# EAGLE design RN-XV_ZigBeeFootprint (EAGLE 6.6.0)
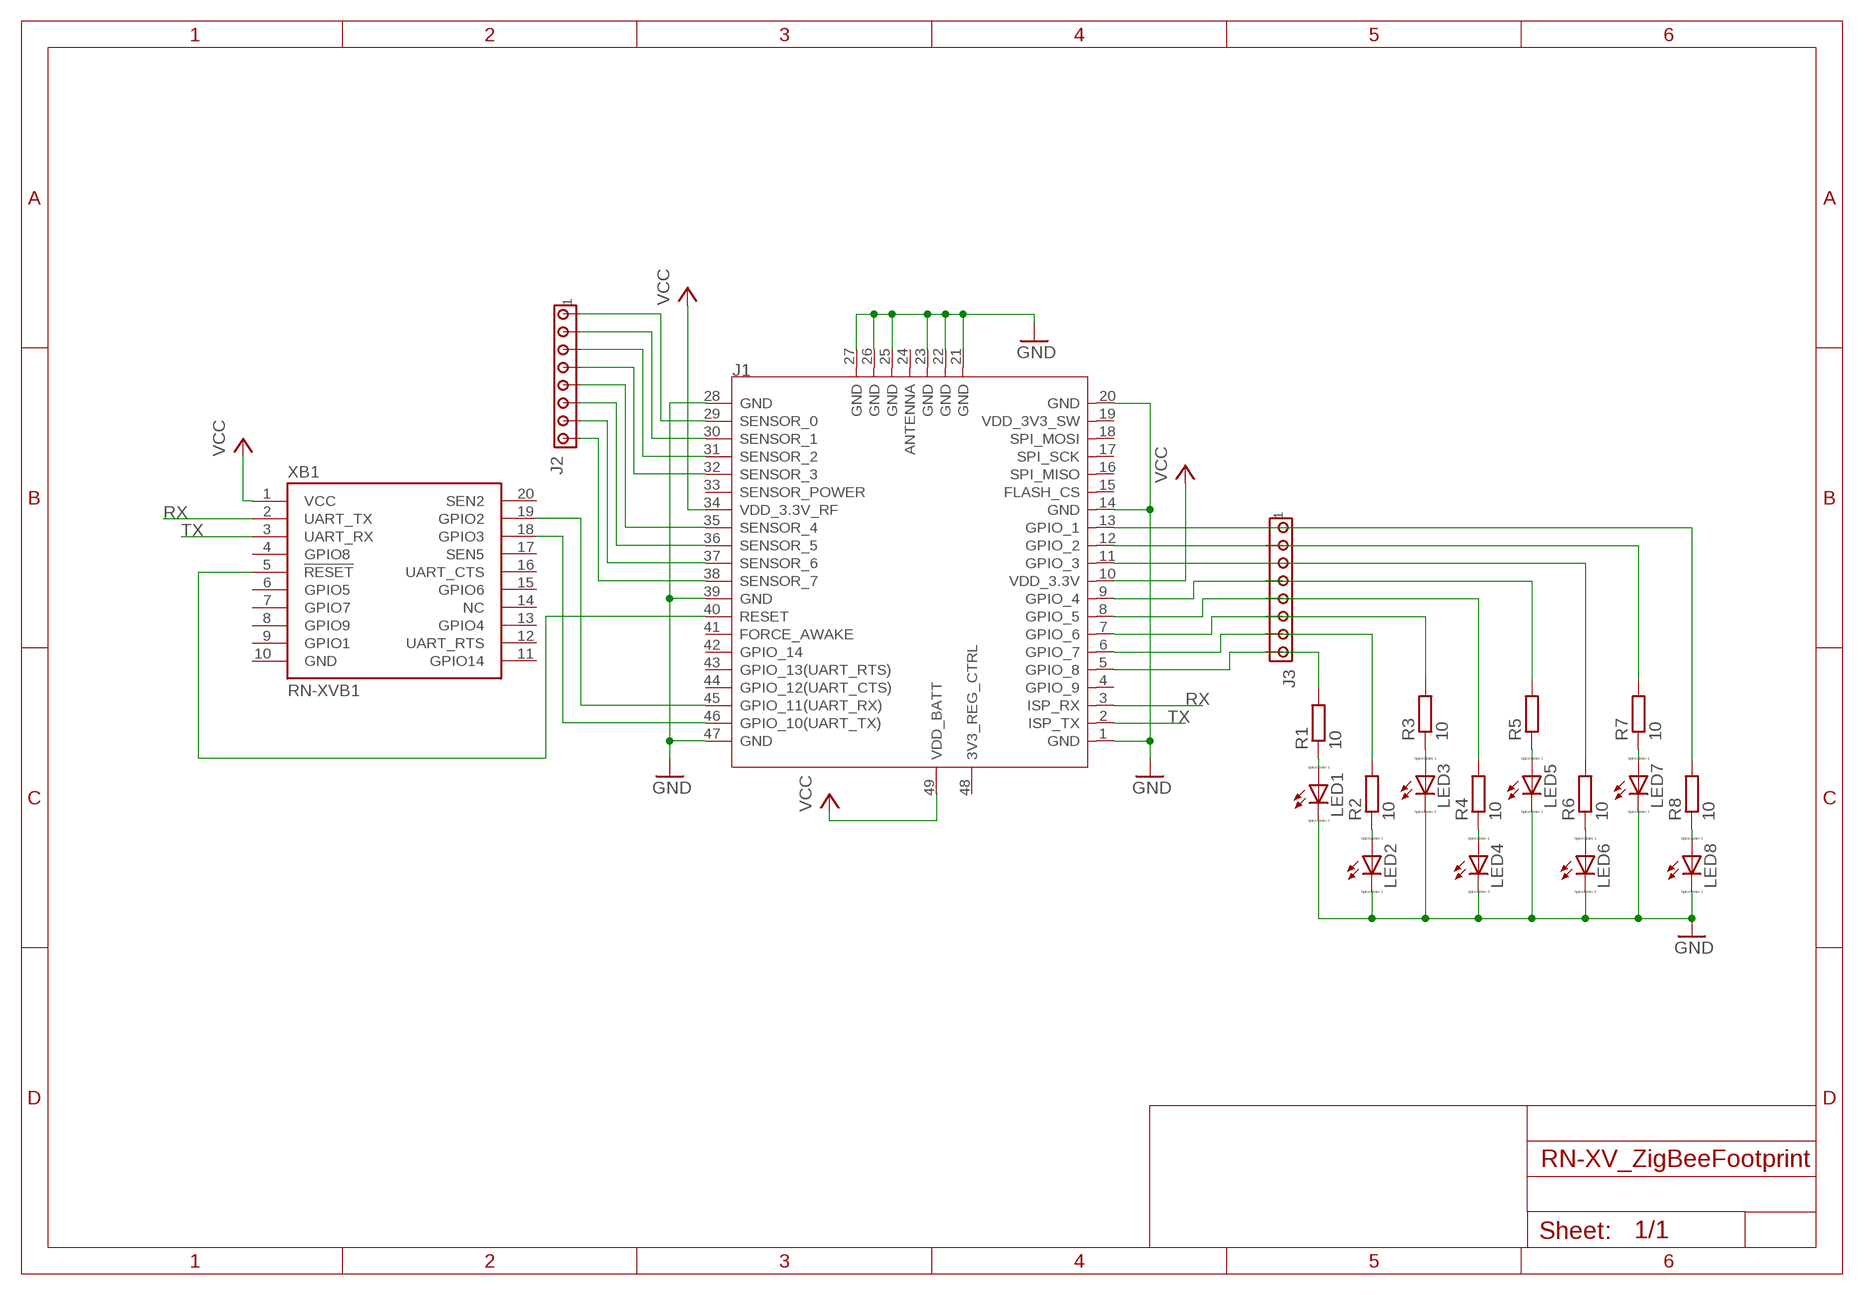
[diagram p0: schematic, sheet 1]

## Parts
J1  MODULE_WIFI-RN-171  [MODULE_49P-1.27-26.67X17.78]
J2  MTA08-100  [10X08MTA]
J3  MTA08-100  [10X08MTA]
LED1  LED_ELD260  [LED_LD260]
LED2  LED_ELD260  [LED_LD260]
LED3  LED_ELD260  [LED_LD260]
LED4  LED_ELD260  [LED_LD260]
LED5  LED_ELD260  [LED_LD260]
LED6  LED_ELD260  [LED_LD260]
LED7  LED_ELD260  [LED_LD260]
LED8  LED_ELD260  [LED_LD260]
R1  10  R-EU_MELF0102W  [MINI_MELF-0102W]
R2  10  R-EU_MELF0102W  [MINI_MELF-0102W]
R3  10  R-EU_MELF0102W  [MINI_MELF-0102W]
R4  10  R-EU_MELF0102W  [MINI_MELF-0102W]
R5  R-EU_MELF0102W  [MINI_MELF-0102W]
R6  10  R-EU_MELF0102W  [MINI_MELF-0102W]
R7  10  R-EU_MELF0102W  [MINI_MELF-0102W]
R8  10  R-EU_MELF0102W  [MINI_MELF-0102W]
XB1  RN-XVB1  [XBEE]

## Nets
GND: J1.1(GND) J1.14(GND) J1.20(GND) J1.21(GND) J1.22(GND) J1.23(GND) J1.25(GND) J1.26(GND) J1.27(GND) J1.28(GND) J1.39(GND) J1.47(GND) LED1.K(C) LED2.K(C) LED3.K(C) LED4.K(C) LED5.K(C) LED6.K(C) LED7.K(C) LED8.K(C)
N$1: J1.38(SENSOR_7) J2.8
N$2: J1.37(SENSOR_6) J2.7
N$3: J1.40(RESET) XB1.5(!RESET)
N$4: J1.46(GPIO_10(UART_TX)) XB1.18(GPIO3)
N$5: J1.45(GPIO_11(UART_RX)) XB1.19(GPIO2)
N$6: J1.36(SENSOR_5) J2.6
N$7: J1.35(SENSOR_4) J2.5
N$8: J1.32(SENSOR_3) J2.4
N$9: J1.30(SENSOR_1) J2.2
N$10: J1.29(SENSOR_0) J2.1
N$11: J1.31(SENSOR_2) J2.3
N$20: LED1.A R1.1
N$23: LED2.A R2.1
N$24: LED3.A R3.1
N$25: LED4.A R4.1
N$26: LED5.A R5.1
N$27: LED6.A R6.1
N$28: LED7.A R7.1
N$29: LED8.A R8.1
N$30: J1.5(GPIO_8) J3.8 R1.2
N$31: J1.6(GPIO_7) J3.7 R2.2
N$32: J1.7(GPIO_6) J3.6 R3.2
N$33: J1.8(GPIO_5) J3.5 R4.2
N$34: J1.9(GPIO_4) J3.4 R5.2
N$35: J1.11(GPIO_3) J3.3 R6.2
N$36: J1.12(GPIO_2) J3.2 R7.2
N$37: J1.13(GPIO_1) J3.1 R8.2
RX: J1.3(ISP_RX) XB1.2(UART_TX)
TX: J1.2(ISP_TX) XB1.3(UART_RX)
VDD_3.3V: J1.10(VDD_3.3V) J1.34(VDD_3.3V_RF) J1.49(VDD_BATT) XB1.1(VCC) ; supply symbol labelled VCC
Unconnected: J1.4(GPIO_9) J1.15(FLASH_CS) J1.16(SPI_MISO) J1.17(SPI_SCK) J1.18(SPI_MOSI) J1.19(VDD_3V3_SW) J1.24(ANTENNA) J1.33(SENSOR_POWER) J1.41(FORCE_AWAKE) J1.42(GPIO_14) J1.43(GPIO_13(UART_RTS)) J1.44(GPIO_12(UART_CTS)) J1.48(3V3_REG_CTRL) XB1.4(GPIO8) XB1.6(GPIO5) XB1.7(GPIO7) XB1.8(GPIO9) XB1.9(GPIO1) XB1.11(GPIO14) XB1.12(UART_RTS) XB1.13(GPIO4) XB1.14(NC) XB1.15(GPIO6) XB1.16(UART_CTS) XB1.17(SEN5) XB1.20(SEN2)

## Power pins joined to a net without a drawn wire
GND: XB1.10(GND)

## Library data of the parts
J1 = rn171:MODULE_WIFI-RN-171: WIFLY GSX 802.11 b/g wireless LAN Module
J2 J3 = con-amp:MTA08-100: AMP connector
LED1-LED8 = eagle-ltspice:LED_E: LED Source: http://www.osram.convergy.de Source: www.luxeon.com Source: www.kingbright.com; SPICEMODEL: NONE; SPICEPREFIX: D; SPICETYPE: diode
R1-R8 = rcl:R-EU_: RESISTOR, European symbol
XB1 = SteveMarple:RN-XV

## Board
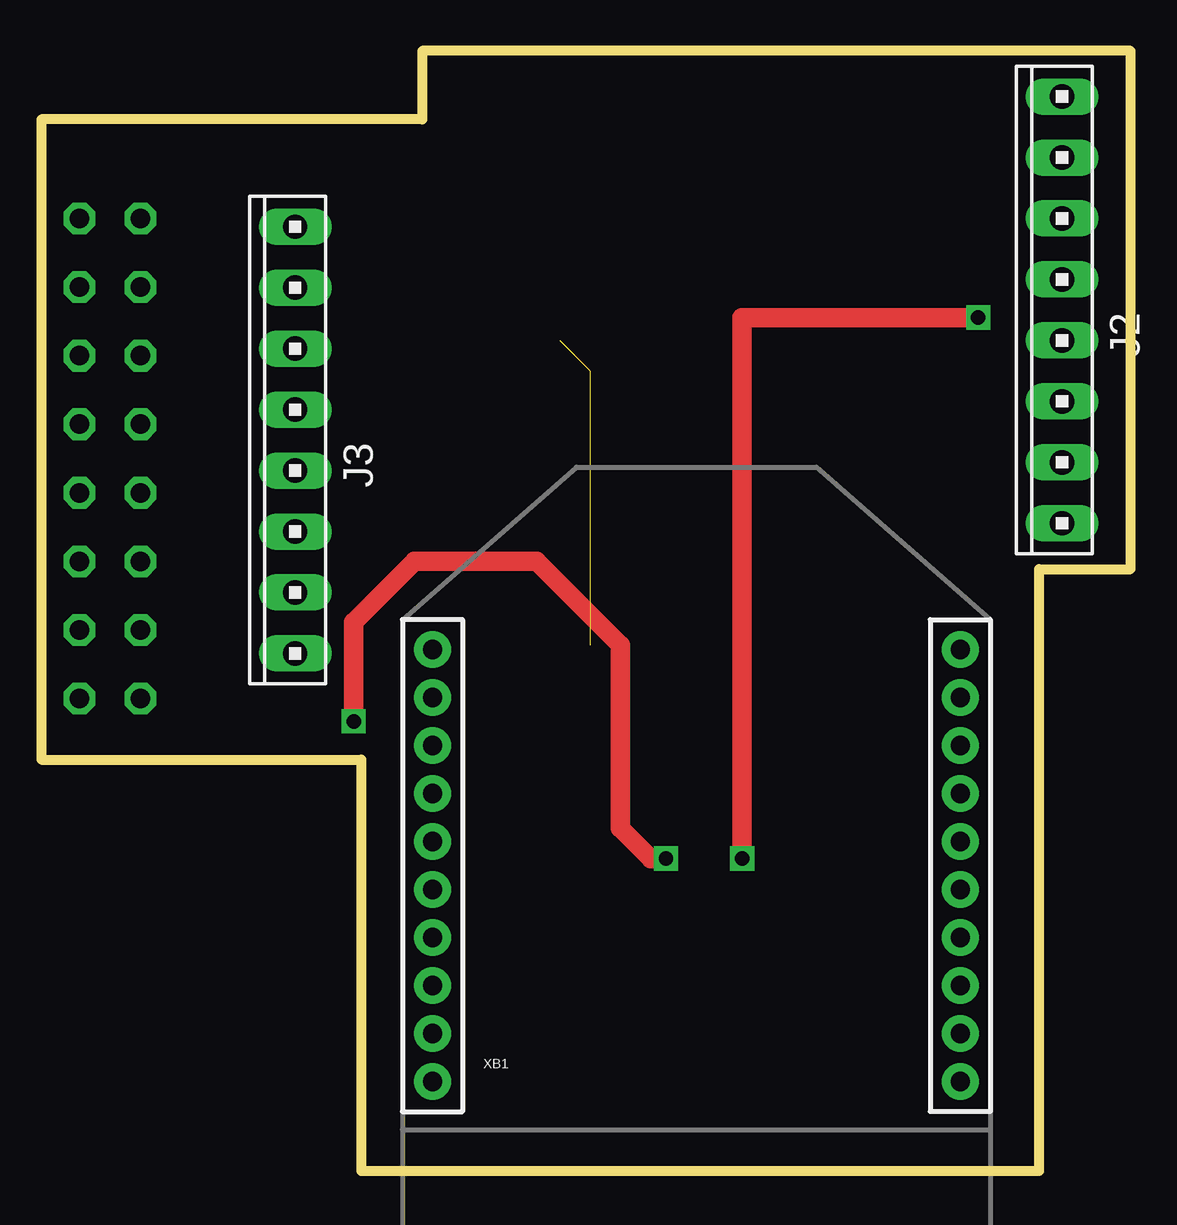
[diagram p1: board, top side]
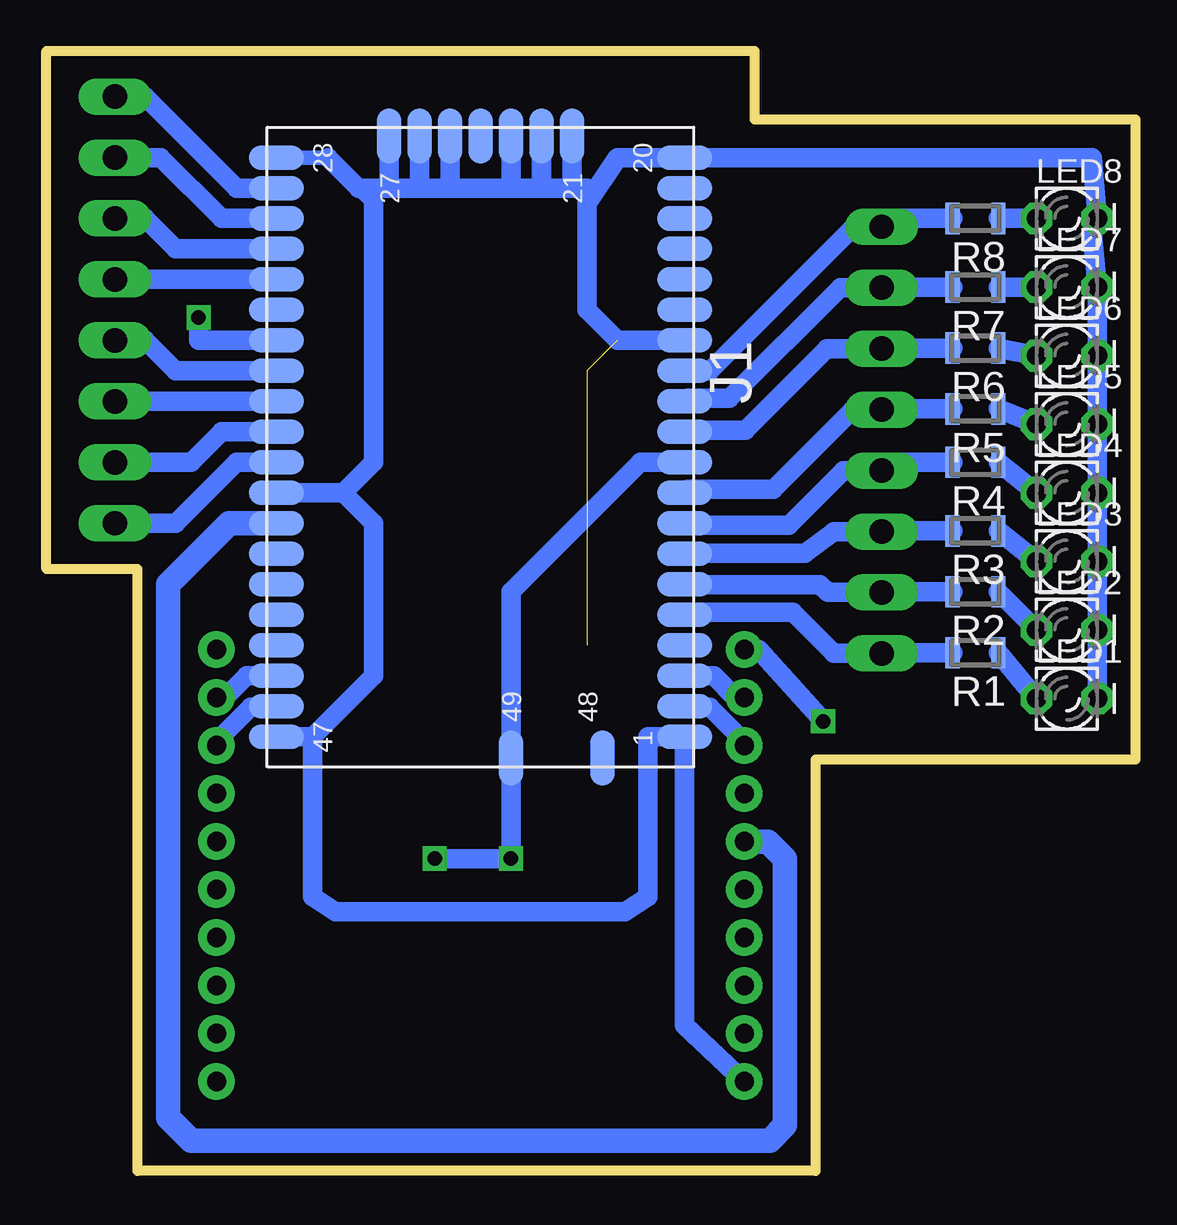
[diagram p2: board, bottom side, seen from below]

No outline drawn. Coordinates in mm, seen from the top.
Copper layers (1*16): Top 0.035mm / dielectric 1.5mm / Bottom 0.035mm
Design rules "default": minimum track width 10mil, minimum drill 24mil, track to track 8mil, track to pad 8mil, pad to pad 8mil, via to via 8mil, smd to smd 8mil, copper to edge 40mil, drill to drill 8mil, minimum pad ring 10mil, minimum via ring 8mil, stop-mask expansion 4mil, vias tented up to drill 0mil, thermal gap 10mil
Milling: 10 lines

### Footprints (pad centres in the part's own frame; a part is rotated, then mirrored left to right if it is on the bottom)
MODULE_49P-1.27-26.67X17.78 = smd 1.016 x 2.286: 1 12.065,8.509; 2 10.795,8.509; 3 9.525,8.509; 4 8.255,8.509; 5 6.985,8.509; 6 5.715,8.509; 7 4.445,8.509; 8 3.175,8.509; 9 1.905,8.509; 10 0.635,8.509; 11 -0.635,8.509; 12 -1.905,8.509; 13 -3.175,8.509; 14 -4.445,8.509; 15 -5.715,8.509; 16 -6.985,8.509; 17 -8.255,8.509; 18 -9.525,8.509; 19 -10.795,8.509; 20 -12.065,8.509; 28 -12.065,-8.509; 29 -10.795,-8.509; 30 -9.525,-8.509; 31 -8.255,-8.509; 32 -6.985,-8.509; 33 -5.715,-8.509; 34 -4.445,-8.509; 35 -3.175,-8.509; 36 -1.905,-8.509; 37 -0.635,-8.509; 38 0.635,-8.509; 39 1.905,-8.509; 40 3.175,-8.509; 41 4.445,-8.509; 42 5.715,-8.509; 43 6.985,-8.509; 44 8.255,-8.509; 45 9.525,-8.509; 46 10.795,-8.509; 47 12.065,-8.509 | smd 2.286 x 1.016: 21 -12.954,3.81; 22 -12.954,2.54; 23 -12.954,1.27; 24 -12.954,0; 25 -12.954,-1.27; 26 -12.954,-2.54; 27 -12.954,-3.81; 48 12.954,5.08; 49 12.954,1.27
10X08MTA = drill 1.016 long: 1 8.89,0; 2 6.35,0; 3 3.81,0; 4 1.27,0; 5 -1.27,0; 6 -3.81,0; 7 -6.35,0; 8 -8.89,0
LED_LD260 = drill 0.813 octagon: A -1.27,0; K 1.27,0
MINI_MELF-0102W = smd 0.6 x 1.3: 1 -0.95,0; 2 0.95,0
XBEE = drill 0.8 pad 1.524: 1 -11,20; 2 -11,18; 3 -11,16; 4 -11,14; 5 -11,12; 6 -11,10; 7 -11,8; 8 -11,6; 9 -11,4; 10 -11,2; 11 11,2; 12 11,4; 13 11,6; 14 11,8; 15 11,10; 16 11,12; 17 11,14; 18 11,16; 19 11,18; 20 11,20

### Placement (x,y rotation side)
J1  13.97,30.16 270 bottom
J2  29.21,35.88 90 top
J3  -2.76,30.45 90 top
LED1  -10.48,19.68 0 bottom
LED2  -10.48,22.54 0 bottom
LED3  -10.48,25.4 0 bottom
LED4  -10.48,28.26 0 bottom
LED5  -10.48,31.11 0 bottom
LED6  -10.48,33.97 0 bottom
LED7  -10.48,36.83 0 bottom
LED8  -10.48,39.69 0 bottom
R1  -6.67,21.59 180 bottom
R2  -6.67,24.13 180 bottom
R3  -6.67,26.67 180 bottom
R4  -6.67,29.53 180 bottom
R5  -6.67,31.75 180 bottom
R6  -6.67,34.29 180 bottom
R7  -6.67,36.83 180 bottom
R8  -6.67,39.69 180 bottom
XB1  13.97,1.73 0 top

### Tracks (layer width: path | path; a pad name or v marks a point on that pad's centre or on a via)
GND  (2 unrouted)
  Bottom 0.61: 9.53,40.32 9.53,40.96 | 19.05,40.96 18.41,40.32 | J1.28 20.32,42.23
  Bottom 0.813: J1.14 8.26,34.61 9.53,35.88 9.53,40.32 8.26,42.23 J1.20 -11.54,42.23 LED8.K -11.54,39.05 LED7.K LED6.K LED5.K LED4.K LED3.K LED2.K LED1.K | 9.53,40.96 10.16,40.96 | 10.16,40.96 11.43,40.96 | 11.43,40.96 12.7,40.96 | 12.7,40.96 15.24,40.96 | 15.24,40.96 16.51,40.96 | 16.51,40.96 17.78,40.96 | 17.78,40.96 19.05,40.96 20.32,42.23 | 18.41,40.32 18.41,29.53 19.68,28.26 | J1.39 19.68,28.26 | 19.68,28.26 18.41,26.99 18.41,20.64 20.95,18.1 | 20.95,18.1 J1.47 | J1.21 10.16,40.96 | J1.22 11.43,40.96 | J1.23 12.7,40.96 | J1.25 15.24,40.96 | J1.26 16.51,40.96 | J1.27 17.78,40.96 | XB1.10 5.46,6.08 J1.1 6.99,18.1 6.99,11.43 7.94,10.79 20,10.79 20.95,11.43 20.95,18.1
N$1
  Bottom 0.813: J1.38 24.13,29.53 26.67,26.99 J2.8
N$2
  Bottom 0.813: J1.37 24.77,30.8 26.04,29.53 J2.7
N$3
  Bottom 1.016: XB1.5 1.98,13.73 1.27,13.02 1.27,1.91 1.91,1.27 26.04,1.27 26.99,2.22 26.99,24.45 24.45,26.99 J1.40
N$4
  Bottom 0.813: J1.46 22.53,19.32 23.56,19.32 24.97,17.91 XB1.18
N$5
  Bottom 0.813: J1.45 23.72,20.64 24.63,19.73 XB1.19
N$6
  Bottom 0.813: J1.36 J2.6
N$7
  Bottom 0.813: J1.35 26.67,33.34 27.94,34.61 J2.5
N$8
  Bottom 0.813: J1.32 J2.4
N$9
  Bottom 0.813: J1.30 24.77,39.69 27.3,42.23 J2.2
N$10
  Bottom 0.813: J1.29 24.13,40.96 27.94,44.77 J2.1
N$11
  Bottom 0.813: J1.31 26.67,38.42 27.94,39.69 J2.3
N$20
  Bottom 0.813: LED1.A R1.1
N$23
  Bottom 0.813: LED2.A R2.1
N$24
  Bottom 0.813: LED3.A R3.1
N$25
  Bottom 0.813: LED4.A R4.1
N$26
  Bottom 0.813: LED5.A R5.1
N$27
  Bottom 0.813: LED6.A R6.1
N$28
  Bottom 0.813: LED7.A R7.1
N$29
  Bottom 0.813: LED8.A R8.1
N$30
  Bottom 0.406: J1.5 5.36,23.28
  Bottom 0.813: 5.36,23.28 0.94,23.28 -0.78,21.57 J3.8 -2.76,21.59 R1.2
N$31
  Bottom 0.406: J1.6 5.45,24.43
  Bottom 0.813: 5.45,24.43 -0.18,24.43 -0.51,24.11 J3.7 -2.76,24.13 R2.2
N$32
  Bottom 0.406: J1.7 5.17,25.74
  Bottom 0.813: 5.17,25.74 0.45,25.74 -0.78,26.64 J3.6 -2.76,26.67 R3.2
N$33
  Bottom 0.406: J1.8 5.38,26.91
  Bottom 0.813: 5.38,26.91 1.1,26.91 -1.17,29.18 J3.5 -2.76,29.53 R4.2
N$34
  Bottom 0.406: J1.9 5.32,28.4
  Bottom 0.813: 5.32,28.4 1.76,28.4 -1.56,31.73 J3.4 -2.76,31.75 R5.2
N$35
  Bottom 0.406: J1.11 5.38,30.87
  Bottom 0.813: 5.38,30.87 2.92,30.87 -0.47,34.27 J3.3 -2.76,34.29 R6.2
N$36
  Bottom 0.406: J1.12 5.33,32.19
  Bottom 0.813: 5.33,32.19 3.58,32.19 -1.03,36.8 J3.2 -2.76,36.83 R7.2
N$37
  Bottom 0.406: J1.13 5.45,33.35 4.41,33.35 | -1.59,39.34 J3.1
  Bottom 0.813: 4.41,33.35 -1.59,39.34 | R8.2 -2.76,39.69 J3.1
RX
  Bottom 0.813: J1.3 4.24,20.64 3.33,19.73 XB1.2
TX
  Bottom 0.813: J1.2 5.41,19.32 4.41,19.32 2.97,17.88 XB1.3
VDD_3.3V  (via drill 0.6)
  Top 0.813: v-0.32,18.73 -0.32,22.86 2.22,25.4 7.3,25.4 10.79,21.91 10.79,14.29 12.06,13.02 v12.7,13.02 | v25.72,35.56 15.88,35.56 v15.88,13.02
  Bottom 0.813: XB1.1 2.36,21.73 v-0.32,18.73 | J1.34 25.72,34.61 v25.72,35.56 | v15.88,13.02 v12.7,13.02 J1.49 12.7,24.13 7.3,29.53 J1.10

### Text on the board
bTest: GND | GND | GND
Document: REV 2.0